# EAGLE design MS5541-CM_Board (EAGLE 7.2.0)
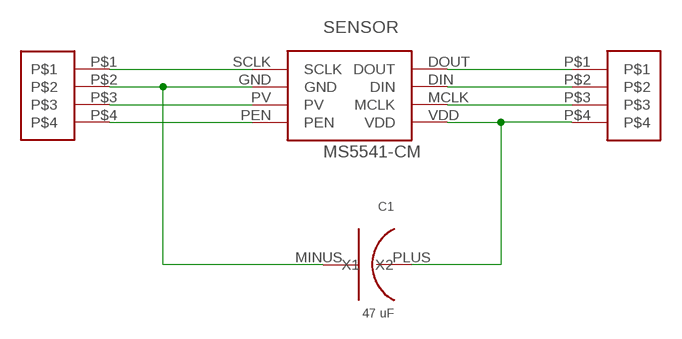
[diagram p0: schematic, sheet 1]

## Parts
C1  47 uF  C_SMD_TA_B_BOTTOM  [C_SMD_TA_B_BOTTOM]
SENSOR  MS5541-CM  [MS5541-CM]
U$3  4-PIN-NONAME  [4-PIN-NONAME]
U$4  4-PIN-NONAME  [4-PIN-NONAME]

## Nets
N$1: SENSOR.SCLK U$4.P$1
N$2: C1.MINUS(X2) SENSOR.GND U$4.P$2
N$3: SENSOR.PV U$4.P$3
N$4: SENSOR.PEN U$4.P$4
N$5: SENSOR.DOUT U$3.P$1
N$6: SENSOR.DIN U$3.P$2
N$7: SENSOR.MCLK U$3.P$3
N$8: C1.PLUS(X1) SENSOR.VDD U$3.P$4

## Library data of the parts
C1 = MyAmSys:C_SMD_TA_B_BOTTOM
SENSOR = MyAmSys:MS5541-CM
U$3 U$4 = MyAmSys:4-PIN-NONAME

## Board
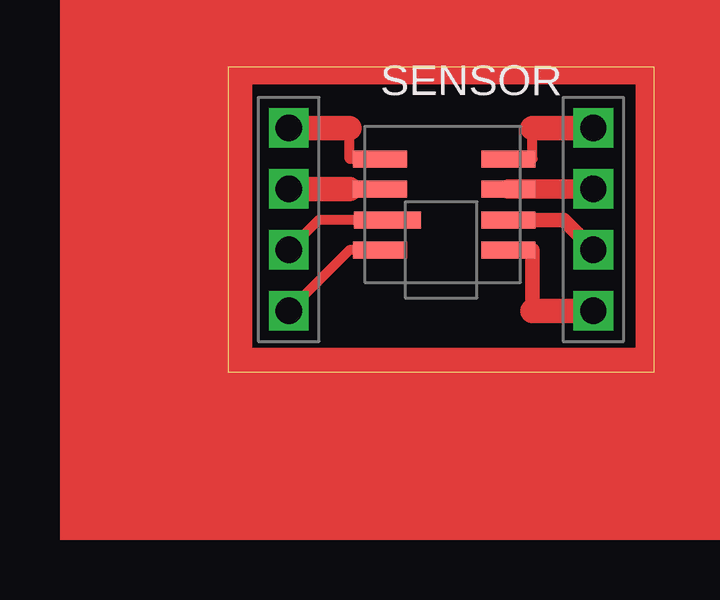
[diagram p1: board, top side]
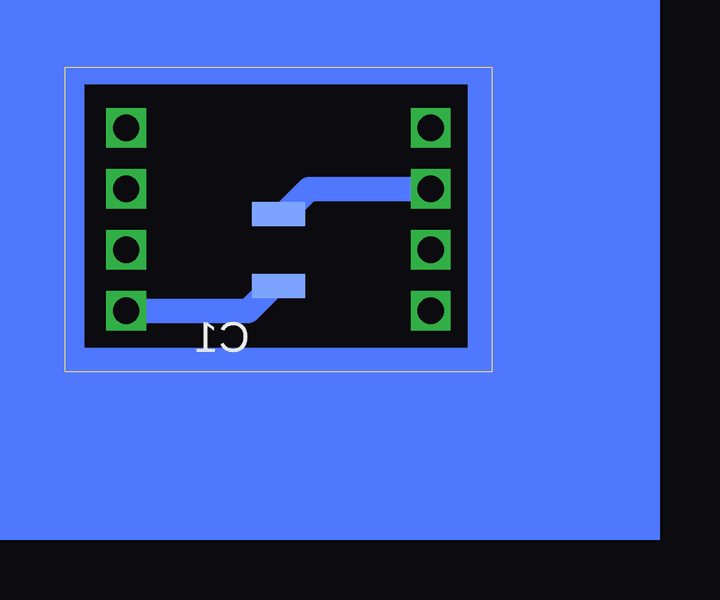
[diagram p2: board, bottom side, seen from below]

Size 17.78 x 12.7 mm. Coordinates in mm from the lower left corner, seen from the top.
Outline: 0,0 17.78,0 17.78,12.7 0,12.7 0,0
Copper layers (1*16): Top 0.035mm / dielectric 1.5mm / Bottom 0.035mm
Design rules "default": minimum track width 10mil, minimum drill 24mil, track to track 8mil, track to pad 8mil, pad to pad 8mil, via to via 8mil, smd to smd 8mil, copper to edge 40mil, drill to drill 8mil, minimum pad ring 10mil, minimum via ring 8mil, stop-mask expansion 4mil, vias tented up to drill 0mil, thermal gap 10mil

### Footprints (pad centres in the part's own frame; a part is rotated, then mirrored left to right if it is on the bottom)
C_SMD_TA_B_BOTTOM = smd 2.2 x 1 bottom: MINUS 0,-1.5; PLUS 0,1.5
MS5541-CM = smd 2.25 x 0.7: DIN 5.35,0; DOUT 5.35,1.25; GND 0,0; MCLK 5.35,-1.3; PEN 0,-2.55; SCLK 0,1.25; VDD 5.35,-2.55 | smd 2.8 x 0.7: PV 0.3,-1.3
4-PIN-NONAME = drill 1.1 square: P$1 0,2.54; P$2 0,0; P$3 0,-2.54; P$4 0,-5.08

### Placement (x,y rotation side)
C1  8.89,5.08 180 top
SENSOR  6.35,7.62 0 top
U$3  15.24,7.62 0 top
U$4  2.54,7.62 0 top

### Tracks (layer width: path | path; a pad name or v marks a point on that pad's centre or on a via)
N$1
  Top 0.406: SENSOR.SCLK 5.08,8.87 5.08,10.16
  Top 1.016: 5.08,10.16 U$4.P$1
N$2
  Top 0.406: SENSOR.GND 5.08,7.62
  Top 1.016: 5.08,7.62 U$4.P$2
  Bottom 1.016: C1.MINUS 8.66,6.58 7.62,7.62 U$4.P$2
N$3
  Top 0.406: SENSOR.PV 3.78,6.32 U$4.P$3
N$4
  Top 0.406: SENSOR.PEN 5.07,5.07 U$4.P$4
N$5
  Top 0.406: SENSOR.DOUT 12.7,8.87 12.7,10.16
  Top 1.016: 12.7,10.16 U$3.P$1
N$6
  Top 0.813: SENSOR.DIN U$3.P$2
N$7
  Top 0.61: SENSOR.MCLK 14,6.32 U$3.P$3
N$8
  Top 0.61: SENSOR.VDD 12.69,5.07 12.7,5.08 12.7,2.54
  Top 1.016: 12.7,2.54 U$3.P$4
  Bottom 1.016: C1.PLUS 9.12,3.58 10.16,2.54 U$3.P$4
(copper drawn outside any net)
  shapes: Bottom area x11, Top area x10